# Altium schematic sheet LAUNCHXL-F28377S_4.SchDoc: LAUNCHXL-F28377S.sch
size 301 x 237 mm; Date: 6/30/2015 1:27:58 PM; DocumentNumber: Document Number:; Revision: REV:; SheetNumber: 5
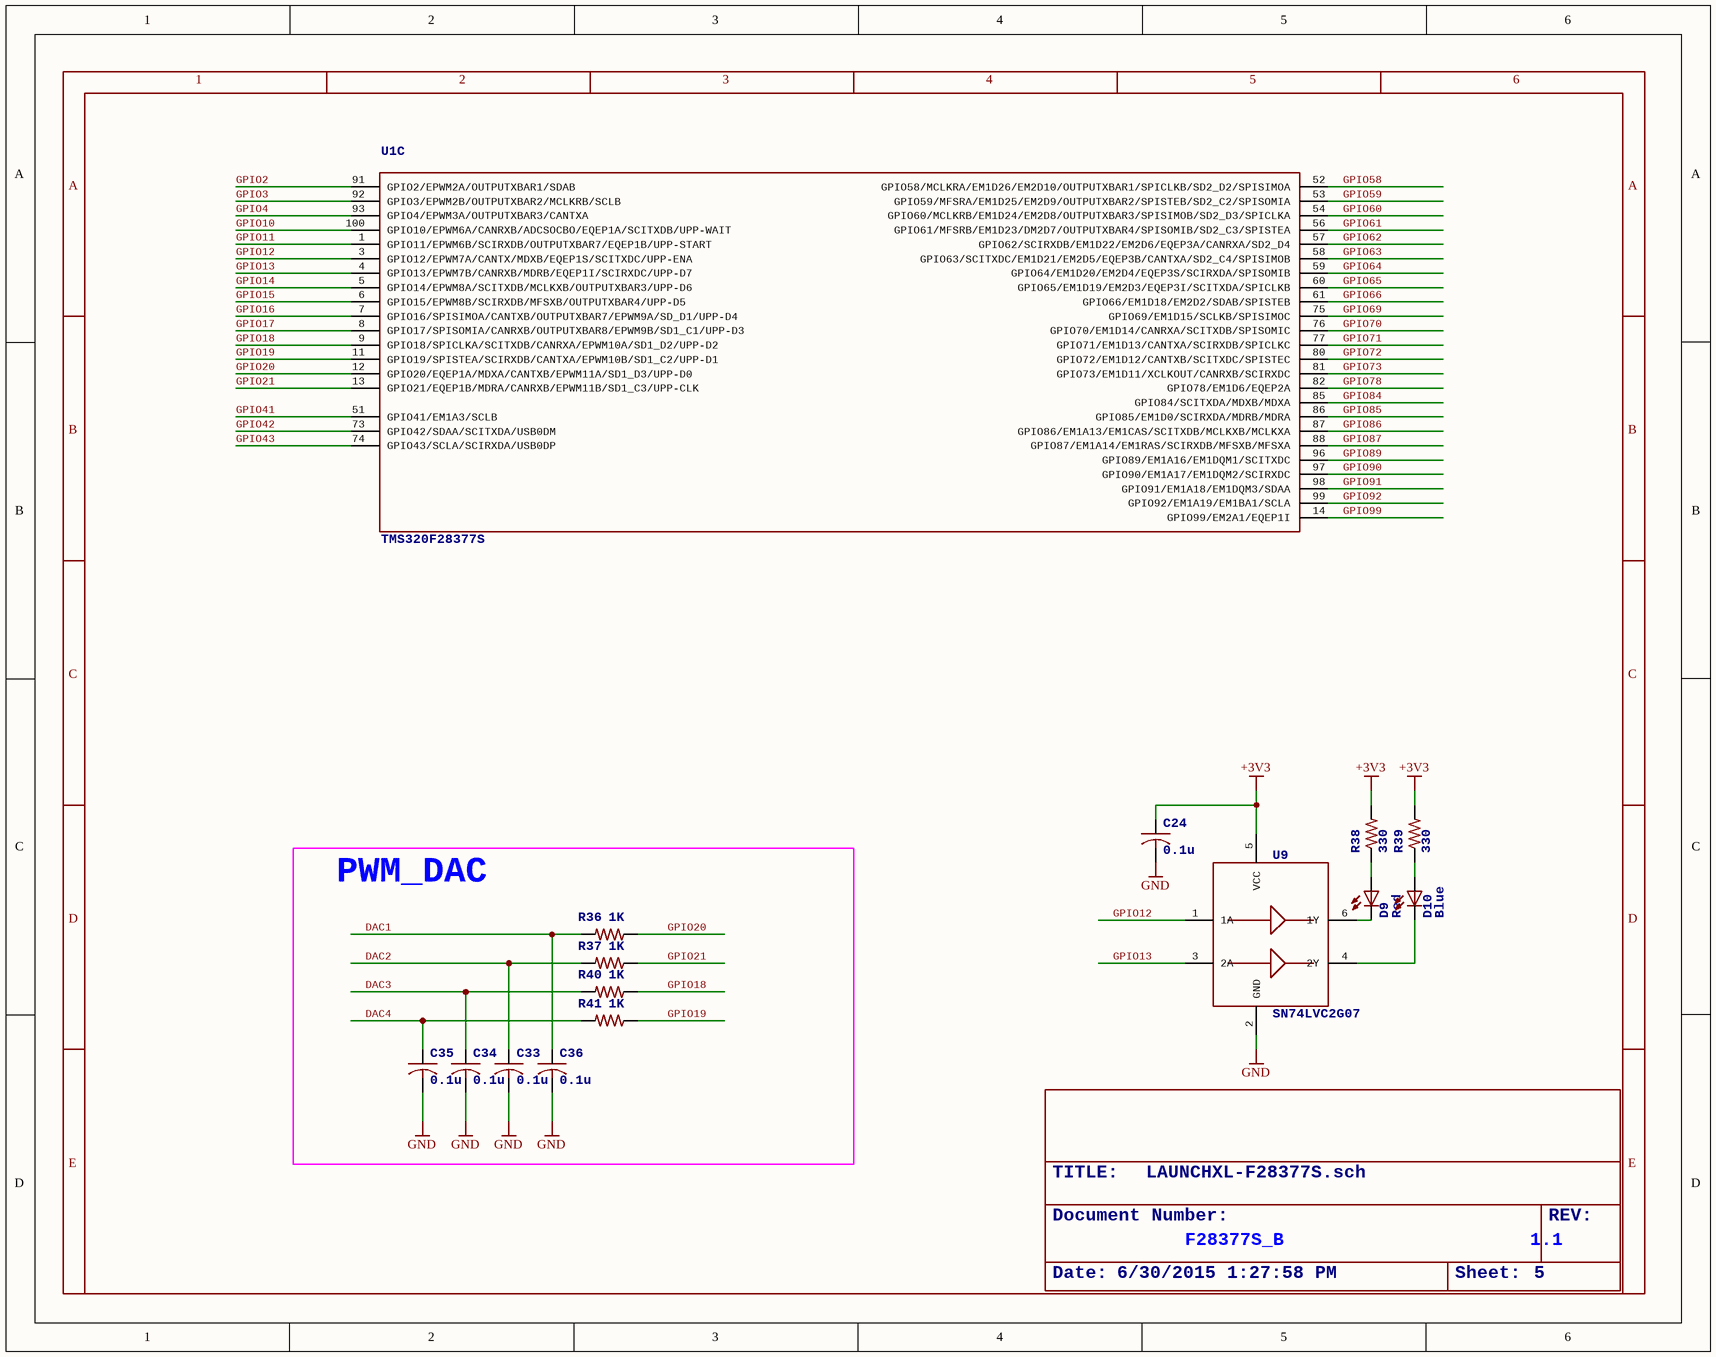
[diagram p0: LAUNCHXL-F28377S_4.SchDoc]

## Parts
C24  0.1u  [C0402]
C33  0.1u  [C0402]
C34  0.1u  [C0402]
C35  0.1u  [C0402]
C36  0.1u  [C0402]
D9  Red  [CHIP-LED0603]
D10  Blue  [CHIP-LED0603]
R36  1K  [R0402]
R37  1K  [R0402]
R38  330  [R0402]
R39  330  [R0402]
R40  1K  [R0402]
R41  1K  [R0402]
U1  TMS320F28377S  [PQFP100_THERMAL]  (part C of 3)
U9  SN74LVC2G07  [SOT23-6-DBV]

## Blocks framed on the sheet
PWM_DAC: C33-C36 R36 R37 R40 R41

## Nets
+3V3: C24.1 R38.2 R39.2 U9.5(VCC)
GND: C24.2 C33.2 C34.2 C35.2 C36.2 U9.2(GND)
DAC1: C36.1 R36.2
DAC2: C33.1 R37.2
DAC3: C34.1 R40.2
DAC4: C35.1 R41.2
GPIO2: U1.91(GPIO2/EPWM2A/OUTPUTXBAR1/SDAB)
GPIO3: U1.92(GPIO3/EPWM2B/OUTPUTXBAR2/MCLKRB/SCLB)
GPIO4: U1.93(GPIO4/EPWM3A/OUTPUTXBAR3/CANTXA)
GPIO10: U1.100(GPIO10/EPWM6A/CANRXB/ADCSOCBO/EQEP1A/SCITXDB/UPP-WAIT)
GPIO11: U1.1(GPIO11/EPWM6B/SCIRXDB/OUTPUTXBAR7/EQEP1B/UPP-START)
GPIO12: U1.3(GPIO12/EPWM7A/CANTX/MDXB/EQEP1S/SCITXDC/UPP-ENA) U9.1(1A)
GPIO13: U1.4(GPIO13/EPWM7B/CANRXB/MDRB/EQEP1I/SCIRXDC/UPP-D7) U9.3(2A)
GPIO14: U1.5(GPIO14/EPWM8A/SCITXDB/MCLKXB/OUTPUTXBAR3/UPP-D6)
GPIO15: U1.6(GPIO15/EPWM8B/SCIRXDB/MFSXB/OUTPUTXBAR4/UPP-D5)
GPIO16: U1.7(GPIO16/SPISIMOA/CANTXB/OUTPUTXBAR7/EPWM9A/SD_D1/UPP-D4)
GPIO17: U1.8(GPIO17/SPISOMIA/CANRXB/OUTPUTXBAR8/EPWM9B/SD1_C1/UPP-D3)
GPIO18: R40.1 U1.9(GPIO18/SPICLKA/SCITXDB/CANRXA/EPWM10A/SD1_D2/UPP-D2)
GPIO19: R41.1 U1.11(GPIO19/SPISTEA/SCIRXDB/CANTXA/EPWM10B/SD1_C2/UPP-D1)
GPIO20: R36.1 U1.12(GPIO20/EQEP1A/MDXA/CANTXB/EPWM11A/SD1_D3/UPP-D0)
GPIO21: R37.1 U1.13(GPIO21/EQEP1B/MDRA/CANRXB/EPWM11B/SD1_C3/UPP-CLK)
GPIO41: U1.51(GPIO41/EM1A3/SCLB)
GPIO42: U1.73(GPIO42/SDAA/SCITXDA/USB0DM)
GPIO43: U1.74(GPIO43/SCLA/SCIRXDA/USB0DP)
GPIO58: U1.52(GPIO58/MCLKRA/EM1D26/EM2D10/OUTPUTXBAR1/SPICLKB/SD2_D2/SPISIMOA)
GPIO59: U1.53(GPIO59/MFSRA/EM1D25/EM2D9/OUTPUTXBAR2/SPISTEB/SD2_C2/SPISOMIA)
GPIO60: U1.54(GPIO60/MCLKRB/EM1D24/EM2D8/OUTPUTXBAR3/SPISIMOB/SD2_D3/SPICLKA)
GPIO61: U1.56(GPIO61/MFSRB/EM1D23/DM2D7/OUTPUTXBAR4/SPISOMIB/SD2_C3/SPISTEA)
GPIO62: U1.57(GPIO62/SCIRXDB/EM1D22/EM2D6/EQEP3A/CANRXA/SD2_D4)
GPIO63: U1.58(GPIO63/SCITXDC/EM1D21/EM2D5/EQEP3B/CANTXA/SD2_C4/SPISIMOB)
GPIO64: U1.59(GPIO64/EM1D20/EM2D4/EQEP3S/SCIRXDA/SPISOMIB)
GPIO65: U1.60(GPIO65/EM1D19/EM2D3/EQEP3I/SCITXDA/SPICLKB)
GPIO66: U1.61(GPIO66/EM1D18/EM2D2/SDAB/SPISTEB)
GPIO69: U1.75(GPIO69/EM1D15/SCLKB/SPISIMOC)
GPIO70: U1.76(GPIO70/EM1D14/CANRXA/SCITXDB/SPISOMIC)
GPIO71: U1.77(GPIO71/EM1D13/CANTXA/SCIRXDB/SPICLKC)
GPIO72: U1.80(GPIO72/EM1D12/CANTXB/SCITXDC/SPISTEC)
GPIO73: U1.81(GPIO73/EM1D11/XCLKOUT/CANRXB/SCIRXDC)
GPIO78: U1.82(GPIO78/EM1D6/EQEP2A)
GPIO84: U1.85(GPIO84/SCITXDA/MDXB/MDXA)
GPIO85: U1.86(GPIO85/EM1D0/SCIRXDA/MDRB/MDRA)
GPIO86: U1.87(GPIO86/EM1A13/EM1CAS/SCITXDB/MCLKXB/MCLKXA)
GPIO87: U1.88(GPIO87/EM1A14/EM1RAS/SCIRXDB/MFSXB/MFSXA)
GPIO89: U1.96(GPIO89/EM1A16/EM1DQM1/SCITXDC)
GPIO90: U1.97(GPIO90/EM1A17/EM1DQM2/SCIRXDC)
GPIO91: U1.98(GPIO91/EM1A18/EM1DQM3/SDAA)
GPIO92: U1.99(GPIO92/EM1A19/EM1BA1/SCLA)
GPIO99: U1.14(GPIO99/EM2A1/EQEP1I)
NetD9_A: D9.A R38.1
NetD9_C: D9.C U9.6(1Y)
NetD10_A: D10.A R39.1
NetD10_C: D10.C U9.4(2Y)

## Notes on the sheet
- F28377S_B
- 1.1
- 1
- 2
- 3
- 4
- 5
- 6
- A
- B
- C
- D
- E

## Library data of the parts
C24 C33-C36 = C-USC0402: <B>CAPACITOR</B>, American symbol
D9 D10 = LEDCHIP-LED0603: <b>LED</b><p> / <u>OSRAM</u>:<br> / - <u>CHIPLED</u><br> / LG R971, LG N971, LY N971, LG Q971, LY Q971, LO R971, LY R971 / LH N974, LH R974<br> / LS Q976, LO Q976, LY Q976<br> / LO Q996<br> / - <u>Hyper CHIPLED</u><br> / LW Q18S<br> / LB Q993, LB Q99A, LB R99A<br> / - <u>SideLED</u><br> / LS A670, LO A670, LY A670, LG A670, LP A670<br> / LB A673, LV A673, LT A673, LW A673<br> / LH A674<br> / LY A675<br> / LS A676, LA A676, LO A676, LY A676, LW A676<br> / LS A679, LY A679, LG A679<br> / -  <u>Hyper Micro SIDELED®</u><br> / LS Y876, LA Y876, LO Y876, LY Y876<br> / LT Y87S<br> / - <u>SmartLED</u><br> / LW L88C, LW L88S<br> / LB L89C, LB L89S, LG L890<br> / LS L89K, LO L89K, LY L89K<br> / LS L896, LA L896, LO L896, LY L896<br> / - <u>TOPLED</u><br> / LS T670, LO T670, LY T670, LG T670, LP T670<br> / LSG T670, LSP T670, LSY T670, LOP T670, LYG T670<br> / LG T671, LOG T671, LSG T671<br> / LB T673, LV T673, LT T673, LW T673<br> / LH T674<br> / LS T676, LA T676, LO T676, LY T676, LB T676, LH T676, LSB T676, LW T676<br> / LB T67C, LV T67C, LT T67C, LS T67K, LO T67K, LY T67K, LW E67C<br> / LS E67B, LA E67B, LO E67B, LY E67B, LB E67C, LV E67C, LT E67C<br> / LW T67C<br> / LS T679, LY T679, LG T679<br> / LS T770, LO T770, LY T770, LG T770, LP T770<br> / LB T773, LV T773, LT T773, LW T773<br> / LH T774<br> / LS E675, LA E675, LY E675, LS T675<br> / LS T776, LA T776, LO T776, LY T776, LB T776<br> / LHGB T686<br> / LT T68C, LB T68C<br> / - <u>Hyper Mini TOPLED®</u><br> / LB M676<br> / - <u>Mini TOPLED Santana®</u><br> / LG M470<br> / LS M47K, LO M47K, LY M47K / <p> / Source: http://www.osram.convergy.de<p> / <u>LUXEON:</u><br> / - <u>LUMILED®</u><br> / LXK2-PW12-R00, LXK2-PW12-S00, LXK2-PW14-U00, LXK2-PW14-V00<br> / LXK2-PM12-R00, LXK2-PM12-S00, LXK2-PM14-U00<br> / LXK2-PE12-Q00, LXK2-PE12-R00, LXK2-PE12-S00, LXK2-PE14-T00, LXK2-PE14-U00<br> / LXK2-PB12-K00, LXK2-PB12-L00, LXK2-PB12-M00, LXK2-PB14-N00, LXK2-PB14-P00, LXK2-PB14-Q00<br> / LXK2-PR12-L00, LXK2-PR12-M00, LXK2-PR14-Q00, LXK2-PR14-R00<br> / LXK2-PD12-Q00, LXK2-PD12-R00, LXK2-PD12-S00<br> / LXK2-PH12-R00, LXK2-PH12-S00<br> / LXK2-PL12-P00, LXK2-PL12-Q00, LXK2-PL12-R00 / <p> / Source: www.luxeon.com<p> / <u>KINGBRIGHT:</U><p> / KA-3528ASYC<br> / Source: www.kingbright.com
R36-R41 = R-US_R0402: <B>RESISTOR</B>, American symbol